# Altium schematic sheet 12.USB OTG_ HUB.SchDoc: CM3 IO
size 420 x 297 mm; Page Create Date: March  8, 1995; Page Number: 12; Page Size: A3; Comment: radxa_1010; Page Count: 20; RevCode: 1.36; Doc: USB OTG/ HUB; DsnPath: D:\WMS\黄工\[RC119]CM3_IO_V1.36\对外资料\radxa_cm3_io_board_v1360.DSN; SchematicName: CM3_IO V1.36; PageName: 12.USB OTG/ HUB; PageSize: A3; TopSchematic: True
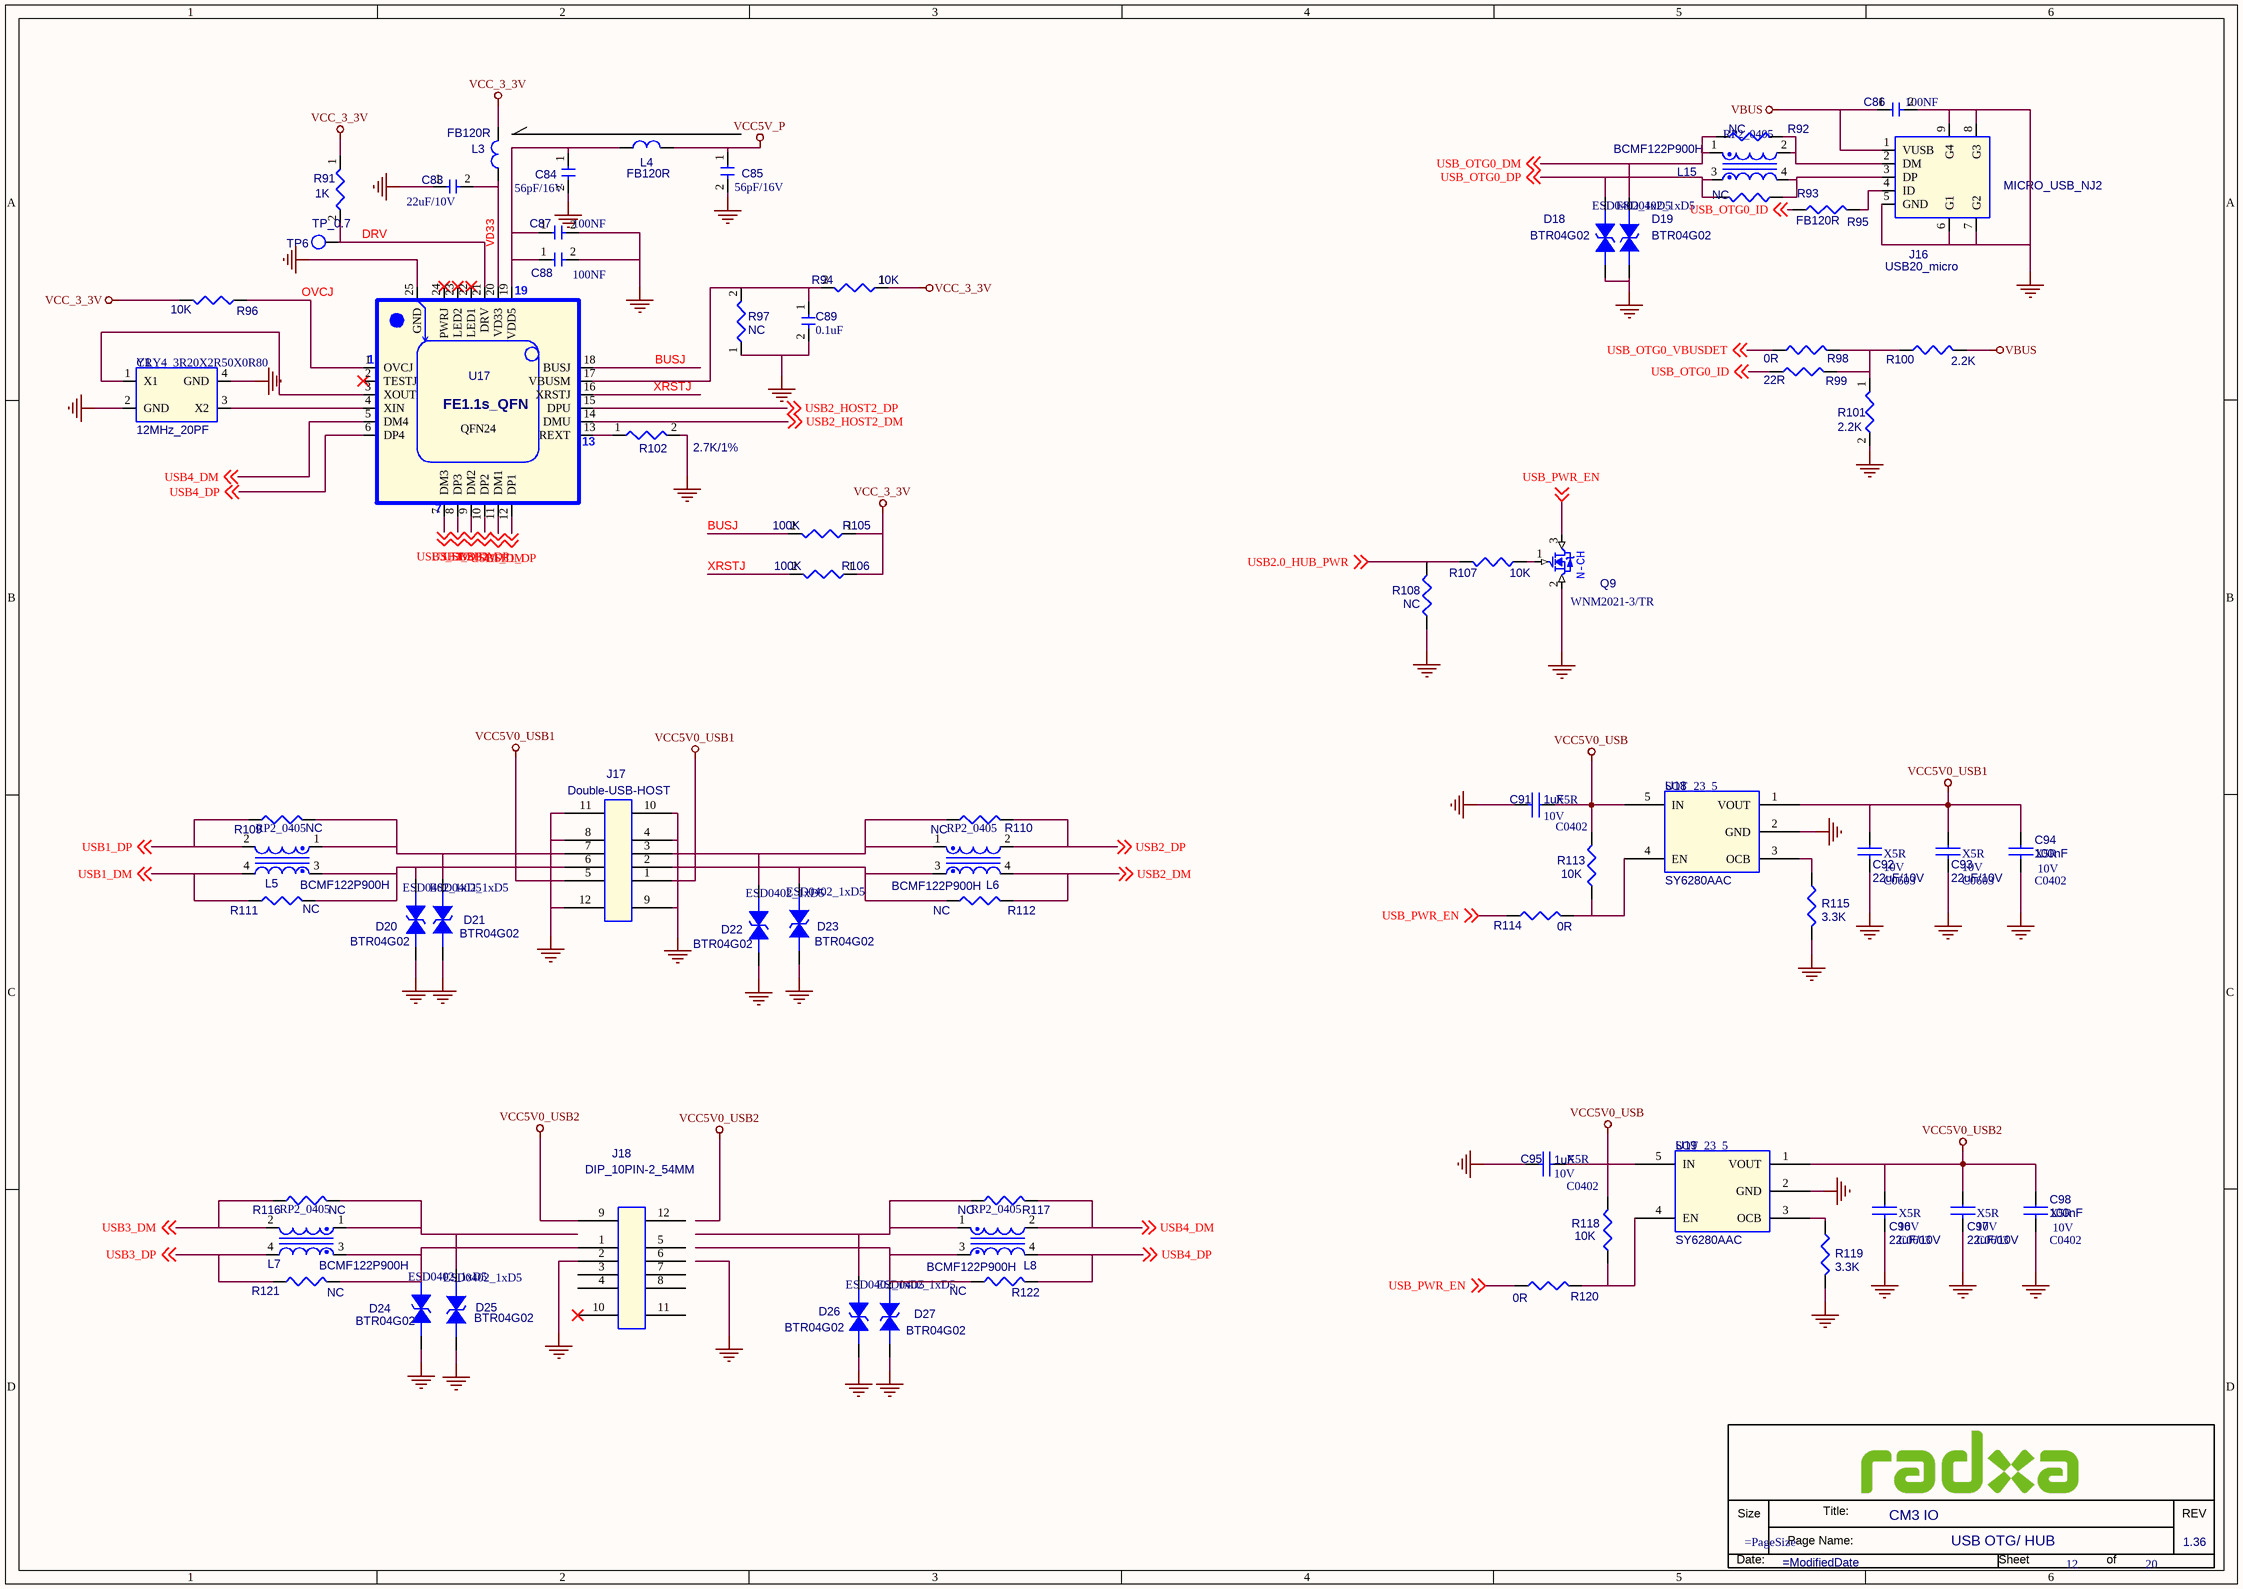
[diagram p0: 12.USB OTG_ HUB.SchDoc]

## Parts
*  Doc: USB OTG/ HUB  RevCode: 1.36  Title: CM3 IO  Page Number: 12  Page Count: 20  (hidden comment: radxa_1010)  (graphical)
C83  22uF/10V  [C0603]
C84  56pF/16V  [C0603]
C85  56pF/16V  [C0603]
C86  100NF  [C0603]
C87  100NF  [C0603]
C88  100NF  [C0603]
C89  0.1uF  [C0603]
C91  1uF  Voltage: 10V  Dielectric: X5R  [C0402]
C92  22uF/10V  Voltage: 10V  Dielectric: X5R  [C0603]
C93  22uF/10V  Voltage: 10V  Dielectric: X5R  [C0603]
C94  100nF  Voltage: 10V  Dielectric: X5R  [C0402]
C95  1uF  Voltage: 10V  Dielectric: X5R  [C0402]
C96  22uF/10V  Voltage: 10V  Dielectric: X5R  [C0603]
C97  22uF/10V  Voltage: 10V  Dielectric: X5R  [C0603]
C98  100nF  Voltage: 10V  Dielectric: X5R  [C0402]
D18  BTR04G02  [ESD0402_1xD5]
D19  BTR04G02  [ESD0402_1xD5]
D20  BTR04G02  [ESD0402_1xD5]
D21  BTR04G02  [ESD0402_1xD5]
D22  BTR04G02  [ESD0402_1xD5]
D23  BTR04G02  [ESD0402_1xD5]
D24  BTR04G02  [ESD0402_1xD5]
D25  BTR04G02  [ESD0402_1xD5]
D26  BTR04G02  [ESD0402_1xD5]
D27  BTR04G02  [ESD0402_1xD5]
J16  USB20_micro  PCB Footprint: MICRO_USB_NJ2  [USB-5PAA]
J17  Double-USB-HOST  [USB_DUAL]
J18  DIP_10PIN-2_54MM  [DIP_10PIN-2_54MM]
L3  FB120R  [R0402]
L4  FB120R  [L0402]
L5  BCMF122P900H  PCB Footprint: RP2_0405  [L0402D]
L6  BCMF122P900H  PCB Footprint: RP2_0405  [L0402D]
L7  BCMF122P900H  PCB Footprint: RP2_0405  [L0402D]
L8  BCMF122P900H  PCB Footprint: RP2_0405  [L0402D]
L15  BCMF122P900H  PCB Footprint: RP2_0405  [L0402D]
Q9  WNM2021-3/TR  [S0T-23]
R91  1K  [R0603]
R92  NC  [R0201]
R93  NC  [R0201]
R94  10K  [R0603]
R95  FB120R  [R0402]
R96  10K  [R0402]
R97  NC  [R0603]
R98  0R  [R0402]
R99  22R  [R0402]
R100  2.2K  [R0402]
R101  2.2K  [R0603]
R102  2.7K/1%  [R0603]
R105  100K  [R0603]
R106  100K  [R0603]
R107  10K  [R0402]
R108  NC  [R0402]
R109  NC  [R0201]
R110  NC  [R0201]
R111  NC  [R0201]
R112  NC  [R0201]
R113  10K  [R0402]
R114  0R  [R0402]
R115  3.3K  [R0402]
R116  NC  [R0201]
R117  NC  [R0201]
R118  10K  [R0402]
R119  3.3K  [R0402]
R120  0R  [R0402]
R121  NC  [R0201]
R122  NC  [R0201]
TP6  TP_0.7  [TEST]
U17  FE1.1s_QFN  [QFN24]
U18  SY6280AAC  [SOT_23_5]
U19  SY6280AAC  [SOT_23_5]
Y1  12MHz_20PF  PCB Footprint: CRY4_3R20X2R50X0R80  [CRY-3225]

## Nets
GND: C83.1 C84.2 C85.2 C86.2 C87.2 C88.2 C89.2 C91.2 C92.2 C93.2 C94.2 C95.2 C96.2 C97.2 C98.2 D18.1 D19.1 D20.1 D21.1 D22.1 D23.1 D24.1 D25.1 D26.1 D27.1 J16.5(GND) J16.6(G1) J16.7(G2) J16.8(G3) J16.9(G4) J17.4 J17.8 J17.9 J17.10 J17.11 J17.12 J18.2 Q9.2(S) R97.1 R101.2 R102.2 R108.2 R115.2 R119.2 U17.25(GND) U18.2(GND) U19.2(GND) Y1.2(GND) Y1.4(GND)
VBUS: C86.1 J16.1(VUSB) R100.2
VCC5V0_USB: C91.1 C95.1 R113.1 R118.1 U18.5(IN) U19.5(IN)
VCC5V0_USB1: C92.1 C93.1 C94.1 J17.1 J17.5 U18.1(VOUT)
VCC5V0_USB2: C96.1 C97.1 C98.1 J18.9 U19.1(VOUT)
VCC5V_P: C85.1 L4.1
VCC_3_3V: L3.2 R91.1 R94.1 R96.1 R105.1 R106.1
BUSJ: R105.2 U17.18(BUSJ)
DRV: R91.2 TP6.1 U17.21(DRV)
OVCJ: R96.2 U17.1(OVCJ)
USB1_DM: L5.4 R111.1 U17.11(DM1) ; off-sheet USB1_DM
USB1_DP: L5.2 R109.1 U17.12(DP1) ; off-sheet USB1_DP
USB2.0_HUB_PWR: R107.2 R108.1 ; off-sheet USB2.0_HUB_PWR
USB2_DM: L6.4 R112.1 U17.9(DM2) ; off-sheet USB2_DM
USB2_DP: L6.2 R110.1 U17.10(DP2) ; off-sheet USB2_DP
USB2_HOST2_DM: U17.14(DMU) ; off-sheet USB2_HOST2_DM
USB2_HOST2_DP: U17.15(DPU) ; off-sheet USB2_HOST2_DP
USB3_DM: L7.2 R116.1 U17.7(DM3) ; off-sheet USB3_DM
USB3_DP: L7.4 R121.1 U17.8(DP3) ; off-sheet USB3_DP
USB4_DM: L8.2 R117.1 U17.5(DM4) ; off-sheet USB4_DM
USB4_DP: L8.4 R122.1 U17.6(DP4) ; off-sheet USB4_DP
USB_OTG0_DM: D19.2 L15.1 R92.2 ; off-sheet USB_OTG0_DM
USB_OTG0_DP: D18.2 L15.3 R93.2 ; off-sheet USB_OTG0_DP
USB_OTG0_ID: R95.2 R99.2 ; off-sheet USB_OTG0_ID
USB_OTG0_VBUSDET: R98.2 ; off-sheet USB_OTG0_VBUSDET
USB_PWR_EN: Q9.3(D) R114.2 R120.2 ; off-sheet USB_PWR_EN
VD33: C83.2 L3.1 U17.20(VD33)
XRSTJ: R106.2 U17.16(XRSTJ)
NetC84_1: C84.1 C87.1 C88.1 L4.2 U17.19(VDD5)
NetC89_1: C89.1 R94.2 R97.2 U17.17(VBUSM)
NetD20_2: D20.2 J17.6 L5.3 R111.2
NetD21_2: D21.2 J17.7 L5.1 R109.2
NetD22_2: D22.2 J17.3 L6.1 R110.2
NetD23_2: D23.2 J17.2 L6.3 R112.2
NetD24_2: D24.2 J18.1 L7.3 R121.2
NetD25_2: D25.2 L7.1 R116.2
NetD26_2: D26.2 L8.1 R117.2
NetD27_2: D27.2 L8.3 R122.2
NetJ16_2: J16.2(DM) L15.2 R92.1
NetJ16_3: J16.3(DP) L15.4 R93.1
NetJ16_4: J16.4(ID) R95.1
NetQ9_1: Q9.1(G) R107.1
NetR98_1: R98.1 R99.1 R100.1 R101.1
NetR102_1: R102.1 U17.13(REXT)
NetR113_2: R113.2 R114.1 U18.4(EN)
NetR115_1: R115.1 U18.3(OCB)
NetR118_2: R118.2 R120.1 U19.4(EN)
NetR119_1: R119.1 U19.3(OCB)
NetU17_3: U17.3(XOUT) Y1.1(X1)
NetU17_4: U17.4(XIN) Y1.3(X2)

Not connected (* = marked no-connect by the designer): J18 3 4 5 6 7 8 10* 11 12; U17 2(TESTJ)* 22(LED1)* 23(LED2)* 24(PWRJ)*

## Notes on the sheet
- (in symbol N-MOSFET) N-CH
- (in symbol radxa_1010) Title:; Size; REV; Page Name:; Date:; Sheet; of

## Library data of the parts
C83 = CAP_0.1uF_0603: Part Reference: C83; Value: 22uF/10V; PCB Footprint: C0603
C84 = CAP_0.1uF_0603: Part Reference: C84; PCB Footprint: C0402; Value: 56pF/16V
C85 = CAP_0.1uF_0603: Part Reference: C85; PCB Footprint: C0402; Value: 56pF/16V
C86 = CAP_0.1uF_0603: Part Reference: C86; PCB Footprint: C0402; Value: 100NF
C87 = CAP_0.1uF_0603: Part Reference: C87; PCB Footprint: C0402; Value: 100NF
C88 = CAP_0.1uF_0603: Part Reference: C88; PCB Footprint: C0402; Value: 100NF
C89 = CAP_0.1uF_0603: Part Reference: C89; PCB Footprint: C0402; Value: 0.1uF
C91 = CAP NP_0: cap,1.00uF,+/-10%,10V,X5R,C0402; Part Reference: C91; Manufacturer: TDK; RK PN: C1005X5R1A105K050BB; Priority: A; C_Voltage: 6.3V; Tolerance: 10%; PCB Footprint: C0402; Value: 1uF; Part Type: C0402; Manufacturer PN: C1005X5R1A105K050BB; Created by: JJJ
C92 = CAP NP_0: cap,100.00nF,+/-10%,10V,X5R,C0402; Part Reference: C92; Manufacturer PN: C1005X5R1A104K050BA; Manufacturer: TDK; Tolerance: 10%; Priority: A; PCB Footprint: C0603; Value: 22uF/10V; Created by: JJJ; Part Type: C0402; RK PN: C1005X5R1A104K050BA
C93 = CAP NP_0: cap,100.00nF,+/-10%,10V,X5R,C0402; Part Reference: C93; Manufacturer PN: C1005X5R1A104K050BA; Manufacturer: TDK; Tolerance: 10%; Priority: A; PCB Footprint: C0603; Value: 22uF/10V; Created by: JJJ; Part Type: C0402; RK PN: C1005X5R1A104K050BA
C94 = CAP NP_0: cap,100.00nF,+/-10%,10V,X5R,C0402; Part Reference: C94; Manufacturer: TDK; RK PN: C1005X5R1A104K050BA; Priority: A; Tolerance: 10%; PCB Footprint: C0402; Value: 100nF; Part Type: C0402; Manufacturer PN: C1005X5R1A104K050BA; Created by: JJJ
C95 = CAP NP_0: cap,1.00uF,+/-10%,10V,X5R,C0402; Part Reference: C95; Manufacturer PN: C1005X5R1A105K050BB; Manufacturer: TDK; Tolerance: 10%; C_Voltage: 6.3V; Priority: A; PCB Footprint: C0402; Value: 1uF; Created by: JJJ; Part Type: C0402; RK PN: C1005X5R1A105K050BB
C96 = CAP NP_0: cap,100.00nF,+/-10%,10V,X5R,C0402; Part Reference: C96; Manufacturer: TDK; RK PN: C1005X5R1A104K050BA; Priority: A; Tolerance: 10%; PCB Footprint: C0603; Value: 22uF/10V; Part Type: C0402; Manufacturer PN: C1005X5R1A104K050BA; Created by: JJJ
C97 = CAP NP_0: cap,100.00nF,+/-10%,10V,X5R,C0402; Part Reference: C97; Manufacturer PN: C1005X5R1A104K050BA; Manufacturer: TDK; Tolerance: 10%; Priority: A; PCB Footprint: C0603; Value: 22uF/10V; Created by: JJJ; Part Type: C0402; RK PN: C1005X5R1A104K050BA
C98 = CAP NP_0: cap,100.00nF,+/-10%,10V,X5R,C0402; Part Reference: C98; Manufacturer: TDK; RK PN: C1005X5R1A104K050BA; Priority: A; Tolerance: 10%; PCB Footprint: C0402; Value: 100nF; Part Type: C0402; Manufacturer PN: C1005X5R1A104K050BA; Created by: JJJ
D18 = DIODE BI_DIR TRIG_0: 1-Line, Bi-directional, Transient Voltage Suppressors.17.5pF.; Part Reference: D18; Manufacturer: WillSemi(韦尔半导体); RK PN: ESD5451N; Priority: A; OPTION: DNP; PCB Footprint: ESD0402_1xD5; Value: BTR04G02; Part Type: ESD_TVS; Manufacturer PN: ESD5451N; Created by: JJJ
D19 = DIODE BI_DIR TRIG_0: 1-Line, Bi-directional, Transient Voltage Suppressors.17.5pF.; Part Reference: D19; Manufacturer PN: ESD5451N; Manufacturer: WillSemi(韦尔半导体); OPTION: DNP; Priority: A; PCB Footprint: ESD0402_1xD5; Value: BTR04G02; Created by: JJJ; Part Type: ESD_TVS; RK PN: ESD5451N
D20 = DIODE BI_DIR TRIG_0: 1-Line, Bi-directional, Transient Voltage Suppressors.17.5pF.; Part Reference: D20; Manufacturer PN: ESD5451N; Manufacturer: WillSemi(韦尔半导体); OPTION: DNP; Priority: A; PCB Footprint: ESD0402_1xD5; Value: BTR04G02; Created by: JJJ; Part Type: ESD_TVS; RK PN: ESD5451N
D21 = DIODE BI_DIR TRIG_0: 1-Line, Bi-directional, Transient Voltage Suppressors.17.5pF.; Part Reference: D21; Manufacturer PN: ESD5451N; Manufacturer: WillSemi(韦尔半导体); OPTION: DNP; Priority: A; PCB Footprint: ESD0402_1xD5; Value: BTR04G02; Created by: JJJ; Part Type: ESD_TVS; RK PN: ESD5451N
D22 = DIODE BI_DIR TRIG_0: 1-Line, Bi-directional, Transient Voltage Suppressors.17.5pF.; Part Reference: D22; Manufacturer PN: ESD5451N; Manufacturer: WillSemi(韦尔半导体); OPTION: DNP; Priority: A; PCB Footprint: ESD0402_1xD5; Value: BTR04G02; Created by: JJJ; Part Type: ESD_TVS; RK PN: ESD5451N
D23 = DIODE BI_DIR TRIG_0: 1-Line, Bi-directional, Transient Voltage Suppressors.17.5pF.; Part Reference: D23; Manufacturer PN: ESD5451N; Manufacturer: WillSemi(韦尔半导体); OPTION: DNP; Priority: A; PCB Footprint: ESD0402_1xD5; Value: BTR04G02; Created by: JJJ; Part Type: ESD_TVS; RK PN: ESD5451N
D24 = DIODE BI_DIR TRIG_0: 1-Line, Bi-directional, Transient Voltage Suppressors.17.5pF.; Part Reference: D24; Manufacturer PN: ESD5451N; Manufacturer: WillSemi(韦尔半导体); OPTION: DNP; Priority: A; PCB Footprint: ESD0402_1xD5; Value: BTR04G02; Created by: JJJ; Part Type: ESD_TVS; RK PN: ESD5451N
D25 = DIODE BI_DIR TRIG_0: 1-Line, Bi-directional, Transient Voltage Suppressors.17.5pF.; Part Reference: D25; Manufacturer PN: ESD5451N; Manufacturer: WillSemi(韦尔半导体); OPTION: DNP; Priority: A; PCB Footprint: ESD0402_1xD5; Value: BTR04G02; Created by: JJJ; Part Type: ESD_TVS; RK PN: ESD5451N
D26 = DIODE BI_DIR TRIG_0: 1-Line, Bi-directional, Transient Voltage Suppressors.17.5pF.; Part Reference: D26; Manufacturer: WillSemi(韦尔半导体); RK PN: ESD5451N; Priority: A; OPTION: DNP; PCB Footprint: ESD0402_1xD5; Value: BTR04G02; Part Type: ESD_TVS; Manufacturer PN: ESD5451N; Created by: JJJ
D27 = DIODE BI_DIR TRIG_0: 1-Line, Bi-directional, Transient Voltage Suppressors.17.5pF.; Part Reference: D27; Manufacturer PN: ESD5451N; Manufacturer: WillSemi(韦尔半导体); OPTION: DNP; Priority: A; PCB Footprint: ESD0402_1xD5; Value: BTR04G02; Created by: JJJ; Part Type: ESD_TVS; RK PN: ESD5451N
J16 = USB20_MICRO: micro型USB2.0座，卧式，贴焊; Part Reference: J16; Manufacturer: 祺华电子; Priority: A; Value: USB20_micro; Created by: JJJ; Manufacturer Part Number: USB20_micro; Part Type: USB Jack; RK PN: USB20_micro
J17 = CON4_0: Part Reference: J17; Value: Double-USB-HOST; PCB Footprint: USB_DUAL
J18 = CON4_0: Part Reference: J18; Value: DIP_10PIN-2_54MM; PCB Footprint: DIP_10PIN-2_54MM
L3 = CHOKE RF: Part Reference: L3; Value: FB120R; PCB Footprint: R0402
L4 = CHOKE RF: Part Reference: L4; Value: FB120R; PCB Footprint: L0402
L5 = INDUCTOR COM: Winding Type Common Mode Choke Coil; Part Reference: L5; Manufacturer PN: SDCW2012-2-900TF; Manufacturer: sunlord; Resonace frequency: 90R@100M; Irms: 330mA; Tolerance: 25%; DC Resistor: 0.35ohm; Priority: A; Value: BCMF122P900H; Created by: JJJ; Part Type: IND; RK PN: SDCW2012-2-900TF
L6 = INDUCTOR COM: Winding Type Common Mode Choke Coil; Part Reference: L6; Manufacturer PN: SDCW2012-2-900TF; Manufacturer: sunlord; Resonace frequency: 90R@100M; Irms: 330mA; Tolerance: 25%; DC Resistor: 0.35ohm; Priority: A; Value: BCMF122P900H; Created by: JJJ; Part Type: IND; RK PN: SDCW2012-2-900TF
L7 = INDUCTOR COM: Winding Type Common Mode Choke Coil; Part Reference: L7; Manufacturer PN: SDCW2012-2-900TF; Manufacturer: sunlord; Resonace frequency: 90R@100M; Irms: 330mA; Tolerance: 25%; DC Resistor: 0.35ohm; Priority: A; Value: BCMF122P900H; Created by: JJJ; Part Type: IND; RK PN: SDCW2012-2-900TF
L8 = INDUCTOR COM: Winding Type Common Mode Choke Coil; Part Reference: L8; Manufacturer: sunlord; RK PN: SDCW2012-2-900TF; Priority: A; DC Resistor: 0.35ohm; Tolerance: 25%; Irms: 330mA; Resonace frequency: 90R@100M; Value: BCMF122P900H; Part Type: IND; Manufacturer PN: SDCW2012-2-900TF; Created by: JJJ
L15 = INDUCTOR COM: Winding Type Common Mode Choke Coil; Part Reference: L15; Manufacturer PN: SDCW2012-2-900TF; Manufacturer: sunlord; Resonace frequency: 90R@100M; Irms: 330mA; Tolerance: 25%; DC Resistor: 0.35ohm; Priority: A; Value: BCMF122P900H; Created by: JJJ; Part Type: IND; RK PN: SDCW2012-2-900TF
Q9 = N-MOSFET: Part Reference: Q9; SANZ_P/N: SK2300; Value: WNM2021-3/TR; Part Type: MOS管; PCB Footprint: S0T-23
R91 = RES_0603: Part Reference: R91; PCB Footprint: R0402; Value: 1K
R92 = RESISTOR_0: 通用厚膜电阻,0R,+/-5%,R0402,1/16W.; Part Reference: R92; Manufacturer: YAGEO; RK PN: RC0402JR-070RL; Priority: A; Tolerance: 5%; Wattage: 1/16W; Value: NC; Part Type: 通用厚膜电阻; Manufacturer PN: RC0402JR-070RL; Created by: YTL; PCB Footprint: R0201
R93 = RESISTOR_0: 通用厚膜电阻,0R,+/-5%,R0402,1/16W.; Part Reference: R93; Manufacturer PN: RC0402JR-070RL; Manufacturer: YAGEO; Wattage: 1/16W; Tolerance: 5%; Priority: A; Value: NC; Created by: YTL; Part Type: 通用厚膜电阻; RK PN: RC0402JR-070RL; PCB Footprint: R0201
R94 = RES_0603: Part Reference: R94; PCB Footprint: R0402; Value: 10K
R95 = RESISTOR_0: 通用厚膜电阻,0R,+/-5%,R0402,1/16W.; Part Reference: R95; Manufacturer: YAGEO; RK PN: RC0402JR-070RL; Priority: A; Tolerance: 5%; Wattage: 1/16W; Value: FB120R; Part Type: 通用厚膜电阻; Manufacturer PN: RC0402JR-070RL; Created by: YTL; PCB Footprint: R0402
R96 = RESISTOR_0: 通用厚膜电阻,0R,+/-5%,R0402,1/16W.; Part Reference: R96; Manufacturer: YAGEO; RK PN: RC0402JR-070RL; Priority: A; Tolerance: 5%; Wattage: 1/16W; option: DNP; Value: 10K; Part Type: 通用厚膜电阻; Manufacturer PN: RC0402JR-070RL; Created by: YTL; PCB Footprint: R0402
R97 = RES_0603: Part Reference: R97; PCB Footprint: R0402; Value: NC
R98 = RESISTOR_0: 通用厚膜电阻,0R,+/-5%,R0402,1/16W.; Part Reference: R98; Manufacturer: YAGEO; RK PN: RC0402JR-070RL; Priority: A; Tolerance: 5%; Wattage: 1/16W; Value: 0R; Part Type: 通用厚膜电阻; Manufacturer PN: RC0402JR-070RL; Created by: YTL; PCB Footprint: R0402
R99 = RESISTOR_0: 通用厚膜电阻,0R,+/-5%,R0402,1/16W.; Part Reference: R99; Manufacturer PN: RC0402JR-070RL; Manufacturer: YAGEO; Wattage: 1/16W; Tolerance: 5%; Priority: A; Value: 22R; Created by: YTL; Part Type: 通用厚膜电阻; RK PN: RC0402JR-070RL; PCB Footprint: R0402
R100 = RESISTOR_0: 通用厚膜电阻,0R,+/-5%,R0402,1/16W.; Part Reference: R100; Manufacturer: YAGEO; RK PN: RC0402JR-070RL; Priority: A; Tolerance: 5%; Wattage: 1/16W; Value: 2.2K; Part Type: 通用厚膜电阻; Manufacturer PN: RC0402JR-070RL; Created by: YTL; PCB Footprint: R0402
R101 = RES_0603: Part Reference: R101; PCB Footprint: R0402; Value: 2.2K
R102 = RES_0603: Part Reference: R102; PCB Footprint: R0402; Value: 2.7K/1%
R105 = RES_0603: Part Reference: R105; PCB Footprint: R0402; Value: 100K
R106 = RES_0603: Part Reference: R106; PCB Footprint: R0402; Value: 100K
R107 = RESISTOR_1: RES,thick film,47KOhm,+/-5%,1/16W,SMD0402; Part Reference: R107; Value: 10K; PCB Footprint: R0402
R108 = RESISTOR_0: RES,thick film,47KOhm,+/-5%,1/16W,SMD0402; Part Reference: R108; MARK: 51K; Value: NC; PCB Footprint: R0402
R109 = RESISTOR_0: 通用厚膜电阻,0R,+/-5%,R0402,1/16W.; Part Reference: R109; Manufacturer: YAGEO; RK PN: RC0402JR-070RL; Priority: A; Tolerance: 5%; Wattage: 1/16W; Value: NC; Part Type: 通用厚膜电阻; Manufacturer PN: RC0402JR-070RL; Created by: YTL; PCB Footprint: R0201
R110 = RESISTOR_0: 通用厚膜电阻,0R,+/-5%,R0402,1/16W.; Part Reference: R110; Manufacturer PN: RC0402JR-070RL; Manufacturer: YAGEO; Wattage: 1/16W; Tolerance: 5%; Priority: A; Value: NC; Created by: YTL; Part Type: 通用厚膜电阻; RK PN: RC0402JR-070RL; PCB Footprint: R0201
R111 = RESISTOR_0: 通用厚膜电阻,0R,+/-5%,R0402,1/16W.; Part Reference: R111; Manufacturer: YAGEO; RK PN: RC0402JR-070RL; Priority: A; Tolerance: 5%; Wattage: 1/16W; Value: NC; Part Type: 通用厚膜电阻; Manufacturer PN: RC0402JR-070RL; Created by: YTL; PCB Footprint: R0201
R112 = RESISTOR_0: 通用厚膜电阻,0R,+/-5%,R0402,1/16W.; Part Reference: R112; Manufacturer PN: RC0402JR-070RL; Manufacturer: YAGEO; Wattage: 1/16W; Tolerance: 5%; Priority: A; Value: NC; Created by: YTL; Part Type: 通用厚膜电阻; RK PN: RC0402JR-070RL; PCB Footprint: R0201
R113 = RESISTOR_0: 通用厚膜电阻,4K7,+/-5%,R0402,1/16W.; Part Reference: R113; Manufacturer PN: RC0402JR-074K7L; Manufacturer: YAGEO; Wattage: 1/16W; Tolerance: 5%; Priority: A; Value: 10K; Created by: YTL; Part Type: 通用厚膜电阻; RK PN: RC0402JR-074K7L; PCB Footprint: R0402
R114 = RESISTOR_0: 通用厚膜电阻,0R,+/-5%,R0402,1/16W.; Part Reference: R114; Manufacturer PN: RC0402JR-070RL; Manufacturer: YAGEO; Wattage: 1/16W; Tolerance: 5%; Priority: A; Value: 0R; Created by: YTL; Part Type: 通用厚膜电阻; RK PN: RC0402JR-070RL; PCB Footprint: R0402
R115 = RESISTOR_0: 通用厚膜电阻,4K7,+/-5%,R0402,1/16W.; Part Reference: R115; Manufacturer PN: RC0402JR-074K7L; Manufacturer: YAGEO; Wattage: 1/16W; Tolerance: 5%; Priority: A; Value: 3.3K; Created by: YTL; Part Type: 通用厚膜电阻; RK PN: RC0402JR-074K7L; PCB Footprint: R0402
R116 = RESISTOR_0: 通用厚膜电阻,0R,+/-5%,R0402,1/16W.; Part Reference: R116; Manufacturer: YAGEO; RK PN: RC0402JR-070RL; Priority: A; Tolerance: 5%; Wattage: 1/16W; Value: NC; Part Type: 通用厚膜电阻; Manufacturer PN: RC0402JR-070RL; Created by: YTL; PCB Footprint: R0201
R117 = RESISTOR_0: 通用厚膜电阻,0R,+/-5%,R0402,1/16W.; Part Reference: R117; Manufacturer PN: RC0402JR-070RL; Manufacturer: YAGEO; Wattage: 1/16W; Tolerance: 5%; Priority: A; Value: NC; Created by: YTL; Part Type: 通用厚膜电阻; RK PN: RC0402JR-070RL; PCB Footprint: R0201
R118 = RESISTOR_0: 通用厚膜电阻,4K7,+/-5%,R0402,1/16W.; Part Reference: R118; Manufacturer: YAGEO; RK PN: RC0402JR-074K7L; Priority: A; Tolerance: 5%; Wattage: 1/16W; Value: 10K; Part Type: 通用厚膜电阻; Manufacturer PN: RC0402JR-074K7L; Created by: YTL; PCB Footprint: R0402
R119 = RESISTOR_0: 通用厚膜电阻,4K7,+/-5%,R0402,1/16W.; Part Reference: R119; Manufacturer PN: RC0402JR-074K7L; Manufacturer: YAGEO; Wattage: 1/16W; Tolerance: 5%; Priority: A; Value: 3.3K; Created by: YTL; Part Type: 通用厚膜电阻; RK PN: RC0402JR-074K7L; PCB Footprint: R0402
R120 = RESISTOR_0: 通用厚膜电阻,0R,+/-5%,R0402,1/16W.; Part Reference: R120; Manufacturer: YAGEO; RK PN: RC0402JR-070RL; Priority: A; Tolerance: 5%; Wattage: 1/16W; Value: 0R; Part Type: 通用厚膜电阻; Manufacturer PN: RC0402JR-070RL; Created by: YTL; PCB Footprint: R0402
R121 = RESISTOR_0: 通用厚膜电阻,0R,+/-5%,R0402,1/16W.; Part Reference: R121; Manufacturer: YAGEO; RK PN: RC0402JR-070RL; Priority: A; Tolerance: 5%; Wattage: 1/16W; Value: NC; Part Type: 通用厚膜电阻; Manufacturer PN: RC0402JR-070RL; Created by: YTL; PCB Footprint: R0201
R122 = RESISTOR_0: 通用厚膜电阻,0R,+/-5%,R0402,1/16W.; Part Reference: R122; Manufacturer PN: RC0402JR-070RL; Manufacturer: YAGEO; Wattage: 1/16W; Tolerance: 5%; Priority: A; Value: NC; Created by: YTL; Part Type: 通用厚膜电阻; RK PN: RC0402JR-070RL; PCB Footprint: R0201
TP6 = TP: Test Point 0.7mm; Part Reference: TP6; PCB Footprint: TP_0R70; RK PN: TESTPOINT_0R7; Priority: A; Value: TP_0.7; Part Type: TP; Created by: JJJ
U17 = FE1_1s_B_QFN24_2: Part Reference: U17; Value: FE1.1s_QFN; PCB Footprint: QFN24
U18 = SWITCH_SY6280: Low Loss Power Distribution Switch; Part Reference: U18; Manufacturer: Silergy（矽力杰）; Priority: A; PCB Footprint: SOT_23_5; Value: SY6280AAC; RK PN: SY6280AAC; Part Type: Switch; Manufacturer PN: SY6280AAC; Created by: JJJ
U19 = SWITCH_SY6280: Low Loss Power Distribution Switch; Part Reference: U19; Manufacturer: Silergy（矽力杰）; Priority: A; PCB Footprint: SOT_23_5; Value: SY6280AAC; RK PN: SY6280AAC; Part Type: Switch; Manufacturer PN: SY6280AAC; Created by: JJJ
Y1 = CRYSTAL_4P: 无源晶振，25M，3225,±10ppm，10pF，Hosonic; Part Reference: Y1; Manufacturer PN: E3SB25.0000F10E11; Manufacturer: Hosonic(鸿星电子); Priority: A; Value: 12MHz_20PF; Created by: JJJ; Part Type: CRYSTAL; RK PN: E3SB25.0000F10E11
* = radxa_1010: Page Create Date: March  8, 1995; Page Size: =PageSize; Page Modify Date: =ModifiedDate